# EAGLE board registers_full_wires (EAGLE 9.5.2), part 1 of 2
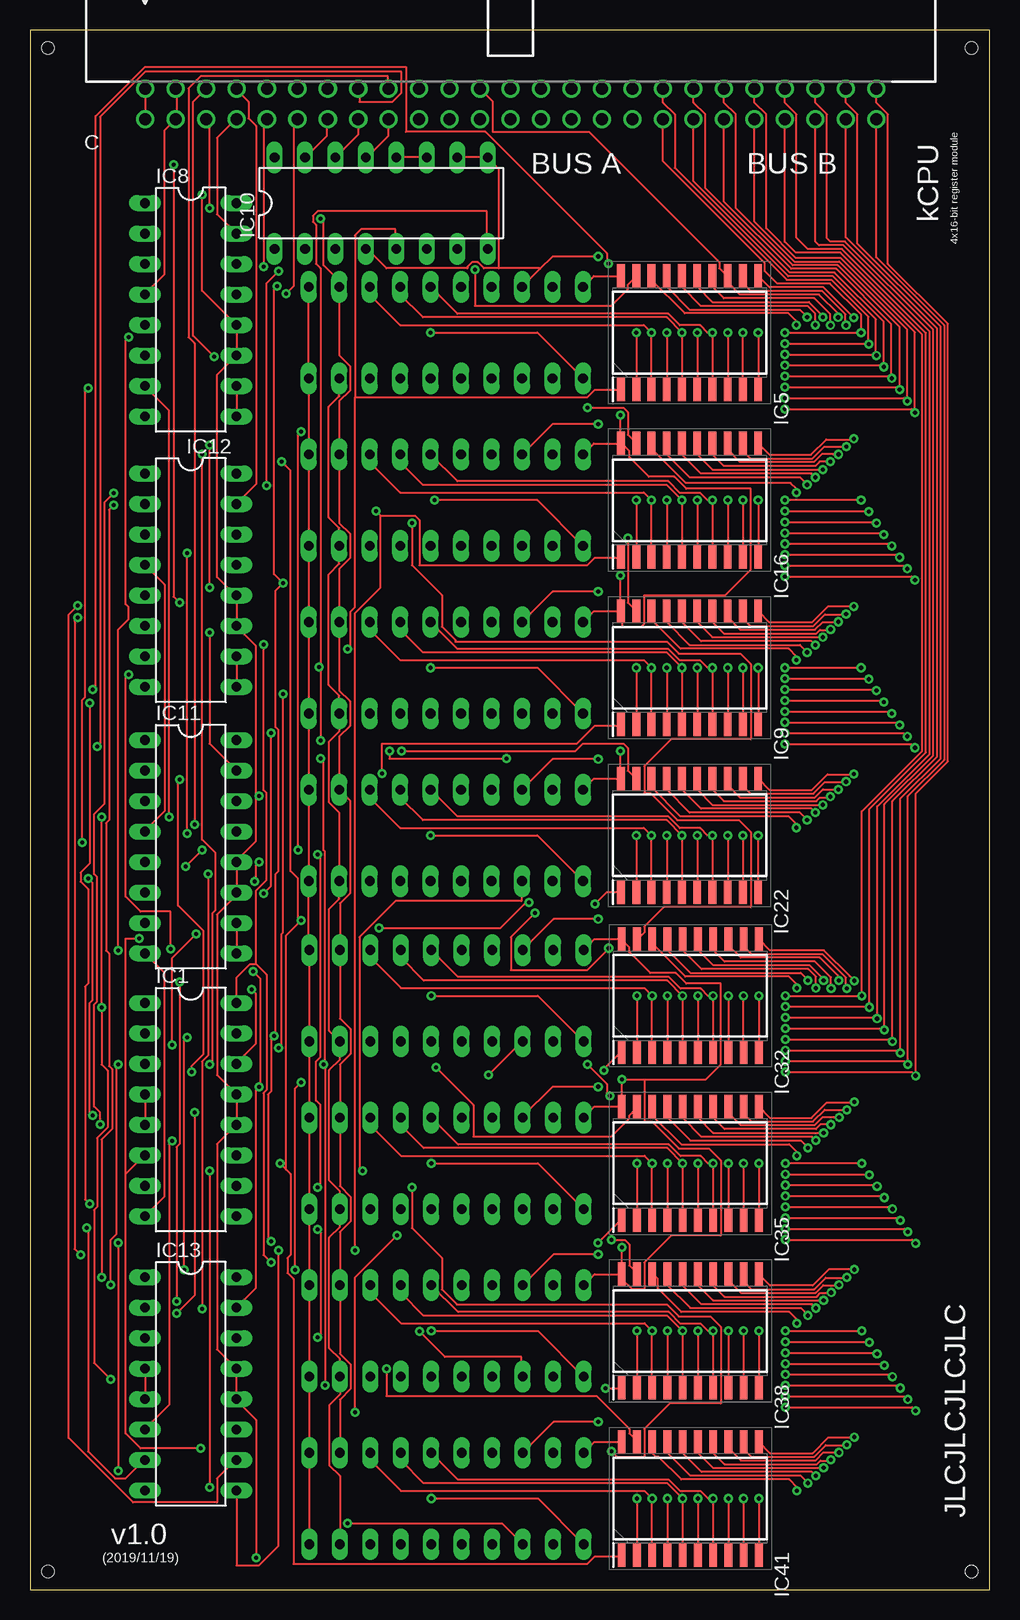
[diagram p2: board, top side]
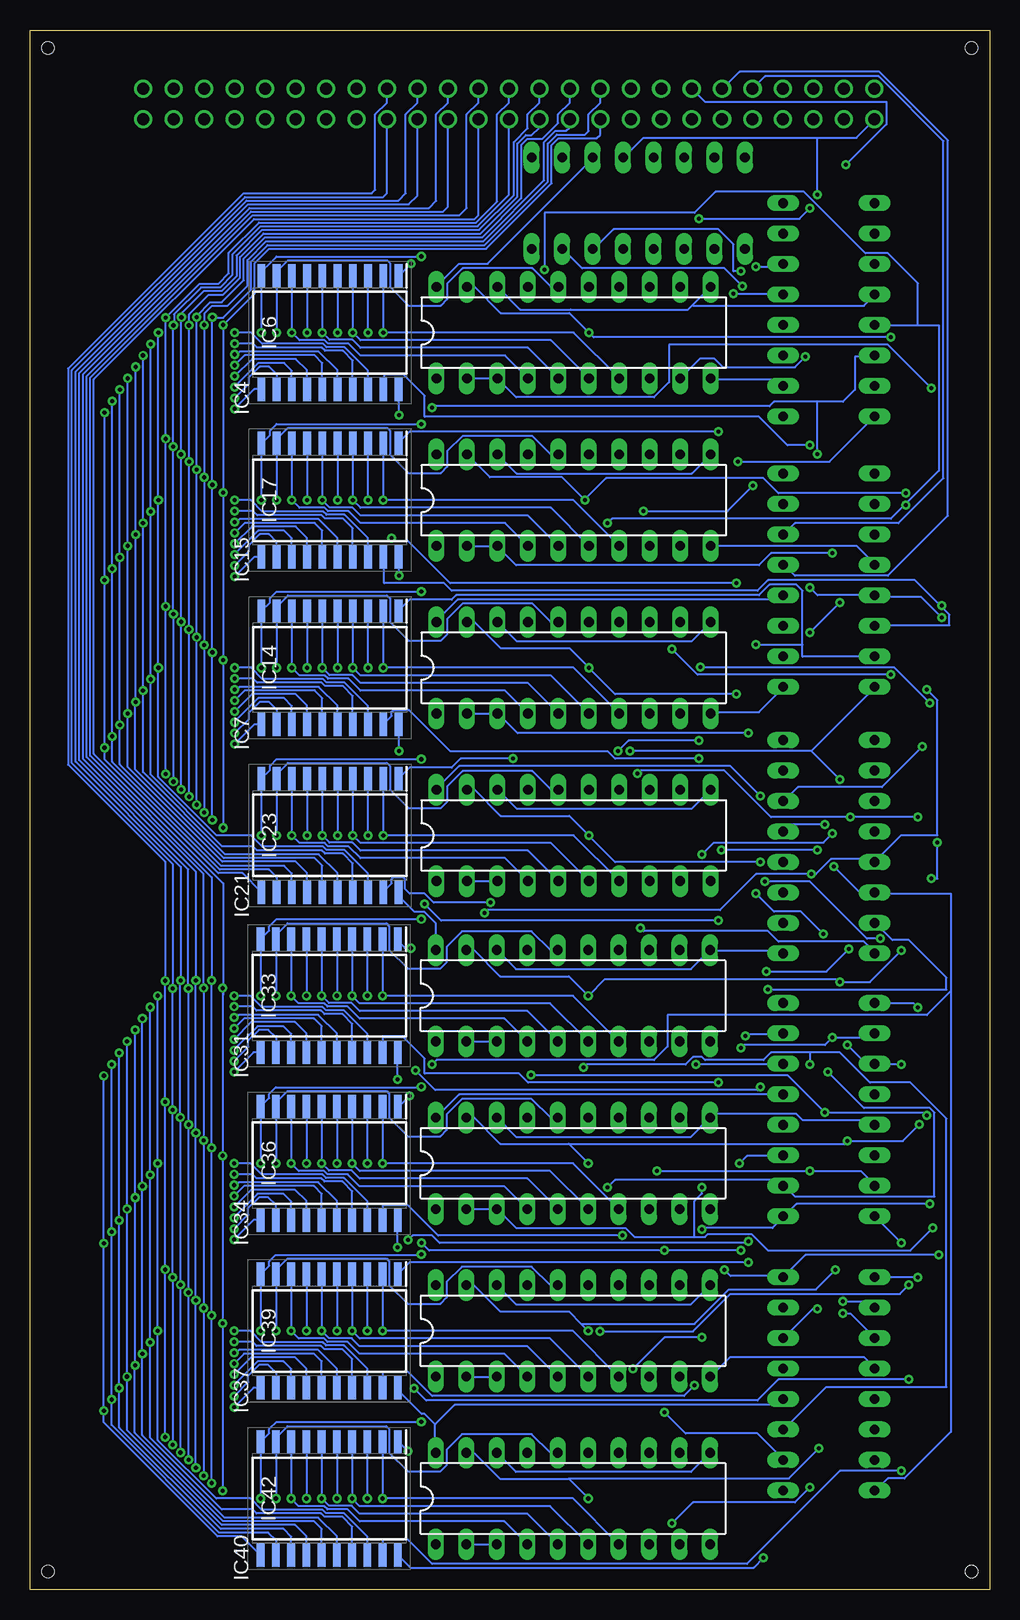
[diagram p3: board, bottom side, seen from below]

Size 80 x 130 mm. Coordinates in mm from the lower left corner, seen from the top.
Outline: 0,0 80,0 80,130 0,130 0,0
Copper layers (1*16): Top 0.035mm / dielectric 1.5mm / Bottom 0.035mm
Design rules "default *": minimum track width 6mil, minimum drill 0.35mm, track to track 6mil, track to pad 6mil, pad to pad 6mil, via to via 6mil, smd to smd 6mil, copper to edge 40mil, drill to drill 6mil, minimum pad ring 10mil, minimum via ring 8mil, stop-mask expansion 4mil, vias tented up to drill 0mil, thermal gap 10mil
Holes 1 mm at 1.5,128.5 78.5,128.5 1.5,1.5 78.5,1.5

## Footprints (pad centres in the part's own frame; a part is rotated, then mirrored left to right if it is on the bottom)
PAK100/2500-5-50 = drill 1 pad 1.422: 1 -30.48,-1.27; 2 -30.48,1.27; 3 -27.94,-1.27; 4 -27.94,1.27; 5 -25.4,-1.27; 6 -25.4,1.27; 7 -22.86,-1.27; 8 -22.86,1.27; 9 -20.32,-1.27; 10 -20.32,1.27; 11 -17.78,-1.27; 12 -17.78,1.27; 13 -15.24,-1.27; 14 -15.24,1.27; 15 -12.7,-1.27; 16 -12.7,1.27; 17 -10.16,-1.27; 18 -10.16,1.27; 19 -7.62,-1.27; 20 -7.62,1.27; 21 -5.08,-1.27; 22 -5.08,1.27; 23 -2.54,-1.27; 24 -2.54,1.27; 25 0,-1.27; 26 0,1.27; 27 2.54,-1.27; 28 2.54,1.27; 29 5.08,-1.27; 30 5.08,1.27; 31 7.62,-1.27; 32 7.62,1.27; 33 10.16,-1.27; 34 10.16,1.27; 35 12.7,-1.27; 36 12.7,1.27; 37 15.24,-1.27; 38 15.24,1.27; 39 17.78,-1.27; 40 17.78,1.27; 41 20.32,-1.27; 42 20.32,1.27; 43 22.86,-1.27; 44 22.86,1.27; 45 25.4,-1.27; 46 25.4,1.27; 47 27.94,-1.27; 48 27.94,1.27; 49 30.48,-1.27; 50 30.48,1.27
DIL16 = drill 0.813 long: 1 -8.89,-3.81; 2 -6.35,-3.81; 3 -3.81,-3.81; 4 -1.27,-3.81; 5 1.27,-3.81; 6 3.81,-3.81; 7 6.35,-3.81; 8 8.89,-3.81; 9 8.89,3.81; 10 6.35,3.81; 11 3.81,3.81; 12 1.27,3.81; 13 -1.27,3.81; 14 -3.81,3.81; 15 -6.35,3.81; 16 -8.89,3.81
DIL20 = drill 0.813 long: 1 -11.43,-3.81; 2 -8.89,-3.81; 3 -6.35,-3.81; 4 -3.81,-3.81; 5 -1.27,-3.81; 6 1.27,-3.81; 7 3.81,-3.81; 8 6.35,-3.81; 9 8.89,-3.81; 10 11.43,-3.81; 11 11.43,3.81; 12 8.89,3.81; 13 6.35,3.81; 14 3.81,3.81; 15 1.27,3.81; 16 -1.27,3.81; 17 -3.81,3.81; 18 -6.35,3.81; 19 -8.89,3.81; 20 -11.43,3.81
SOIC127P1030X265-20N = smd 1.95 x 0.65: 1 -4.725,5.715; 2 -4.725,4.445; 3 -4.725,3.175; 4 -4.725,1.905; 5 -4.725,0.635; 6 -4.725,-0.635; 7 -4.725,-1.905; 8 -4.725,-3.175; 9 -4.725,-4.445; 10 -4.725,-5.715; 11 4.725,-5.715; 12 4.725,-4.445; 13 4.725,-3.175; 14 4.725,-1.905; 15 4.725,-0.635; 16 4.725,0.635; 17 4.725,1.905; 18 4.725,3.175; 19 4.725,4.445; 20 4.725,5.715

## Placement (x,y rotation side)
C  2550-5  [PAK100/2500-5-50]  40.07,123.83 0 top
IC1  74AC11032  [DIL16]  13.4,40.01 270 top
IC4  74HCT299N  [DIL20]  34.67,104.78 0 bottom
IC5  SN74CBT3345DW  [SOIC127P1030X265-20N]  54.99,104.78 90 top
IC6  SN74CBT3345DW  [SOIC127P1030X265-20N]  54.99,104.78 270 bottom
IC7  74HCT299N  [DIL20]  34.67,76.83 0 bottom
IC8  74AC11138  [DIL16]  13.4,106.68 270 top
IC9  SN74CBT3345DW  [SOIC127P1030X265-20N]  54.99,76.83 90 top
IC10  74AC11238  [DIL16]  29.28,115.57 0 top
IC11  74AC11238  [DIL16]  13.4,61.91 270 top
IC12  74AC11138  [DIL16]  13.4,84.14 270 top
IC13  74AC11032  [DIL16]  13.4,17.14 270 top
IC14  SN74CBT3345DW  [SOIC127P1030X265-20N]  54.99,76.83 270 bottom
IC15  74HCT299N  [DIL20]  34.67,90.81 0 bottom
IC16  SN74CBT3345DW  [SOIC127P1030X265-20N]  54.99,90.81 90 top
IC17  SN74CBT3345DW  [SOIC127P1030X265-20N]  54.99,90.81 270 bottom
IC21  74HCT299N  [DIL20]  34.67,62.87 0 bottom
IC22  SN74CBT3345DW  [SOIC127P1030X265-20N]  54.99,62.87 90 top
IC23  SN74CBT3345DW  [SOIC127P1030X265-20N]  54.99,62.87 270 bottom
IC31  74HCT299N  [DIL20]  34.73,49.5 0 bottom
IC32  SN74CBT3345DW  [SOIC127P1030X265-20N]  55.05,49.5 90 top
IC33  SN74CBT3345DW  [SOIC127P1030X265-20N]  55.05,49.5 270 bottom
IC34  74HCT299N  [DIL20]  34.73,35.53 0 bottom
IC35  SN74CBT3345DW  [SOIC127P1030X265-20N]  55.05,35.53 90 top
IC36  SN74CBT3345DW  [SOIC127P1030X265-20N]  55.05,35.53 270 bottom
IC37  74HCT299N  [DIL20]  34.73,21.56 0 bottom
IC38  SN74CBT3345DW  [SOIC127P1030X265-20N]  55.05,21.56 90 top
IC39  SN74CBT3345DW  [SOIC127P1030X265-20N]  55.05,21.56 270 bottom
IC40  74HCT299N  [DIL20]  34.73,7.59 0 bottom
IC41  SN74CBT3345DW  [SOIC127P1030X265-20N]  55.05,7.59 90 top
IC42  SN74CBT3345DW  [SOIC127P1030X265-20N]  55.05,7.59 270 bottom